# EAGLE design mobo-z-minus-sun-sense-flex-connector (EAGLE 9.6.2)
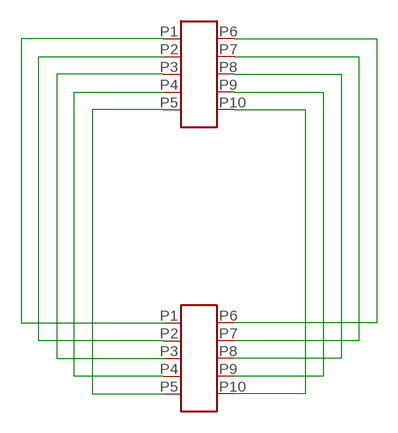
[diagram p0: schematic, sheet 1]

## Parts
X1  5X2_SMD_2.54MM_HEADER  [5X2_HEADER]
X2  5X2_SMD_2.54MM_HEADER  [5X2_HEADER]

## Nets
N$1: X1.P6 X2.P6
N$2: X1.P7 X2.P7
N$3: X1.P8 X2.P8
N$4: X1.P9 X2.P9
N$5: X1.P10 X2.P10
N$6: X1.P5 X2.P5
N$7: X1.P4 X2.P4
N$8: X1.P3 X2.P3
N$9: X1.P2(P2\) X2.P2(P2\)
N$10: X1.P1 X2.P1

## Library data of the parts
X1 X2 = SMD_headers:5X2_SMD_2.54MM_HEADER

## Board
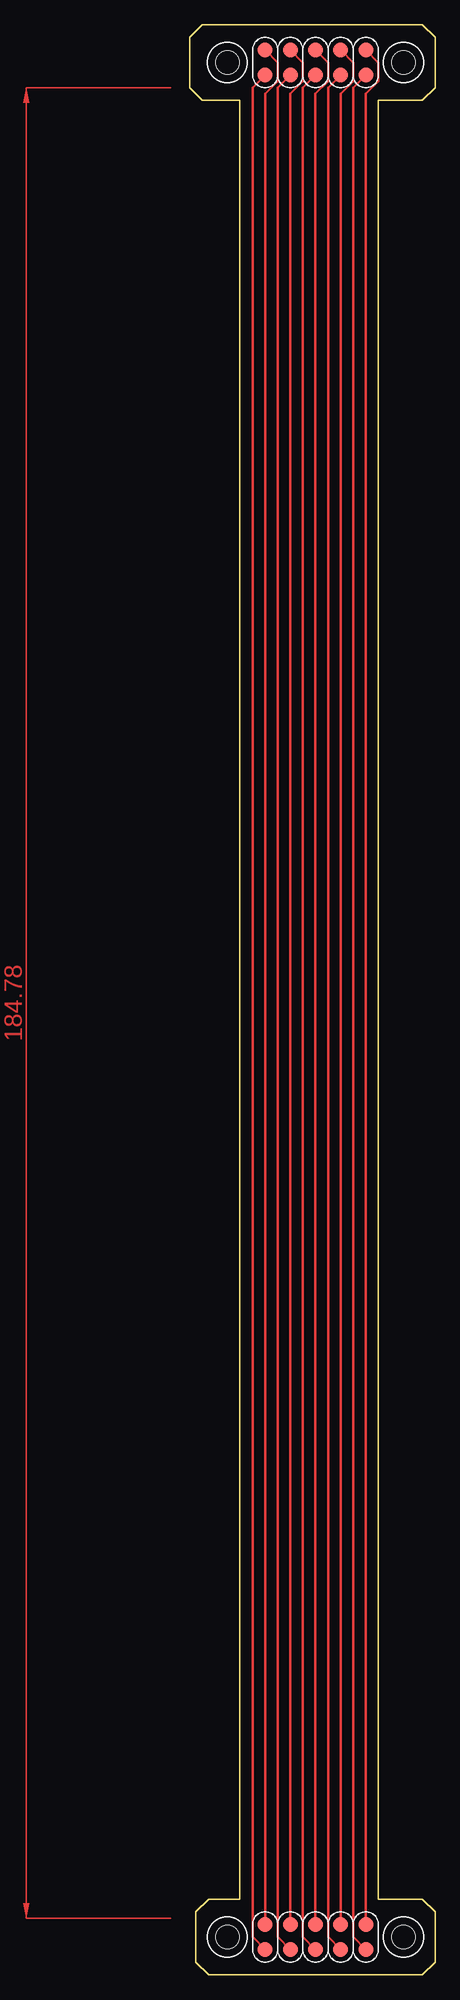
[diagram p1: board, top side]

Size 24.77 x 196.85 mm. Coordinates in mm from the lower left corner, seen from the top.
Outline: 0.64,1.27 0.64,6.35 1.91,7.62 5.08,7.62 5.08,189.23 1.27,189.23 0,190.5 0,195.58 1.27,196.85 23.49,196.85 24.77,195.58 24.77,190.5 23.49,189.23 19.05,189.23 19.05,7.62 23.49,7.62 24.77,6.35 24.77,1.27 23.49,0 1.91,0 0.64,1.27
Copper layers (1*16): Top 0.035mm / dielectric 1.5mm / Bottom 0.035mm
Design rules "default": minimum track width 6mil, minimum drill 0.35mm, track to track 6mil, track to pad 6mil, pad to pad 6mil, via to via 6mil, smd to smd 6mil, copper to edge 40mil, drill to drill 6mil, minimum pad ring 10mil, minimum via ring 8mil, stop-mask expansion 4mil, vias tented up to drill 0mil, thermal gap 10mil
Holes 2.4 mm at 3.81,193.04 21.59,193.04 3.81,3.81 21.59,3.81

### Footprints (pad centres in the part's own frame; a part is rotated, then mirrored left to right if it is on the bottom)
5X2_HEADER = smd 1.524 x 1.524: P1 5.08,1.27; P2 2.54,1.27; P3 0,1.27; P4 -2.54,1.27; P5 -5.08,1.27; P6 5.08,-1.27; P7 2.54,-1.27; P8 0,-1.27; P9 -2.54,-1.27; P10 -5.08,-1.27

### Placement (x,y rotation side)
X1  12.7,193.04 180 top
X2  12.7,3.81 180 top

### Tracks (layer width: path | path; a pad name or v marks a point on that pad's centre or on a via)
N$1
  Top 0.254: X2.P6 7.62,189.87 8.89,191.13 8.89,193.04 X1.P6
N$2
  Top 0.254: X2.P7 10.16,189.87 11.43,191.13 11.43,193.04 X1.P7
N$3
  Top 0.254: X2.P8 12.7,189.87 13.97,191.13 13.97,193.04 X1.P8
N$4
  Top 0.254: X2.P9 15.24,189.87 16.51,191.13 16.51,193.04 X1.P9
N$5
  Top 0.254: X2.P10 17.78,189.87 19.05,191.13 19.05,193.04 X1.P10
N$6
  Top 0.254: X1.P5 16.51,190.5 16.51,3.81 X2.P5
N$7
  Top 0.254: X1.P4 13.97,190.5 13.97,3.81 X2.P4
N$8
  Top 0.254: X1.P3 11.43,190.5 11.43,3.81 X2.P3
N$9
  Top 0.254: 10.16,191.13 X1.P2 8.89,190.5 8.89,189.87 8.89,189.23 8.89,3.81 X2.P2
N$10
  Top 0.254: X2.P1 6.35,3.81 6.35,190.5 X1.P1
(copper drawn outside any net)
  shapes: Top area x1

### Text on the board
Document: need atleast 163.93 mm length